# EasyEDA schematic RS-core-schematic.json
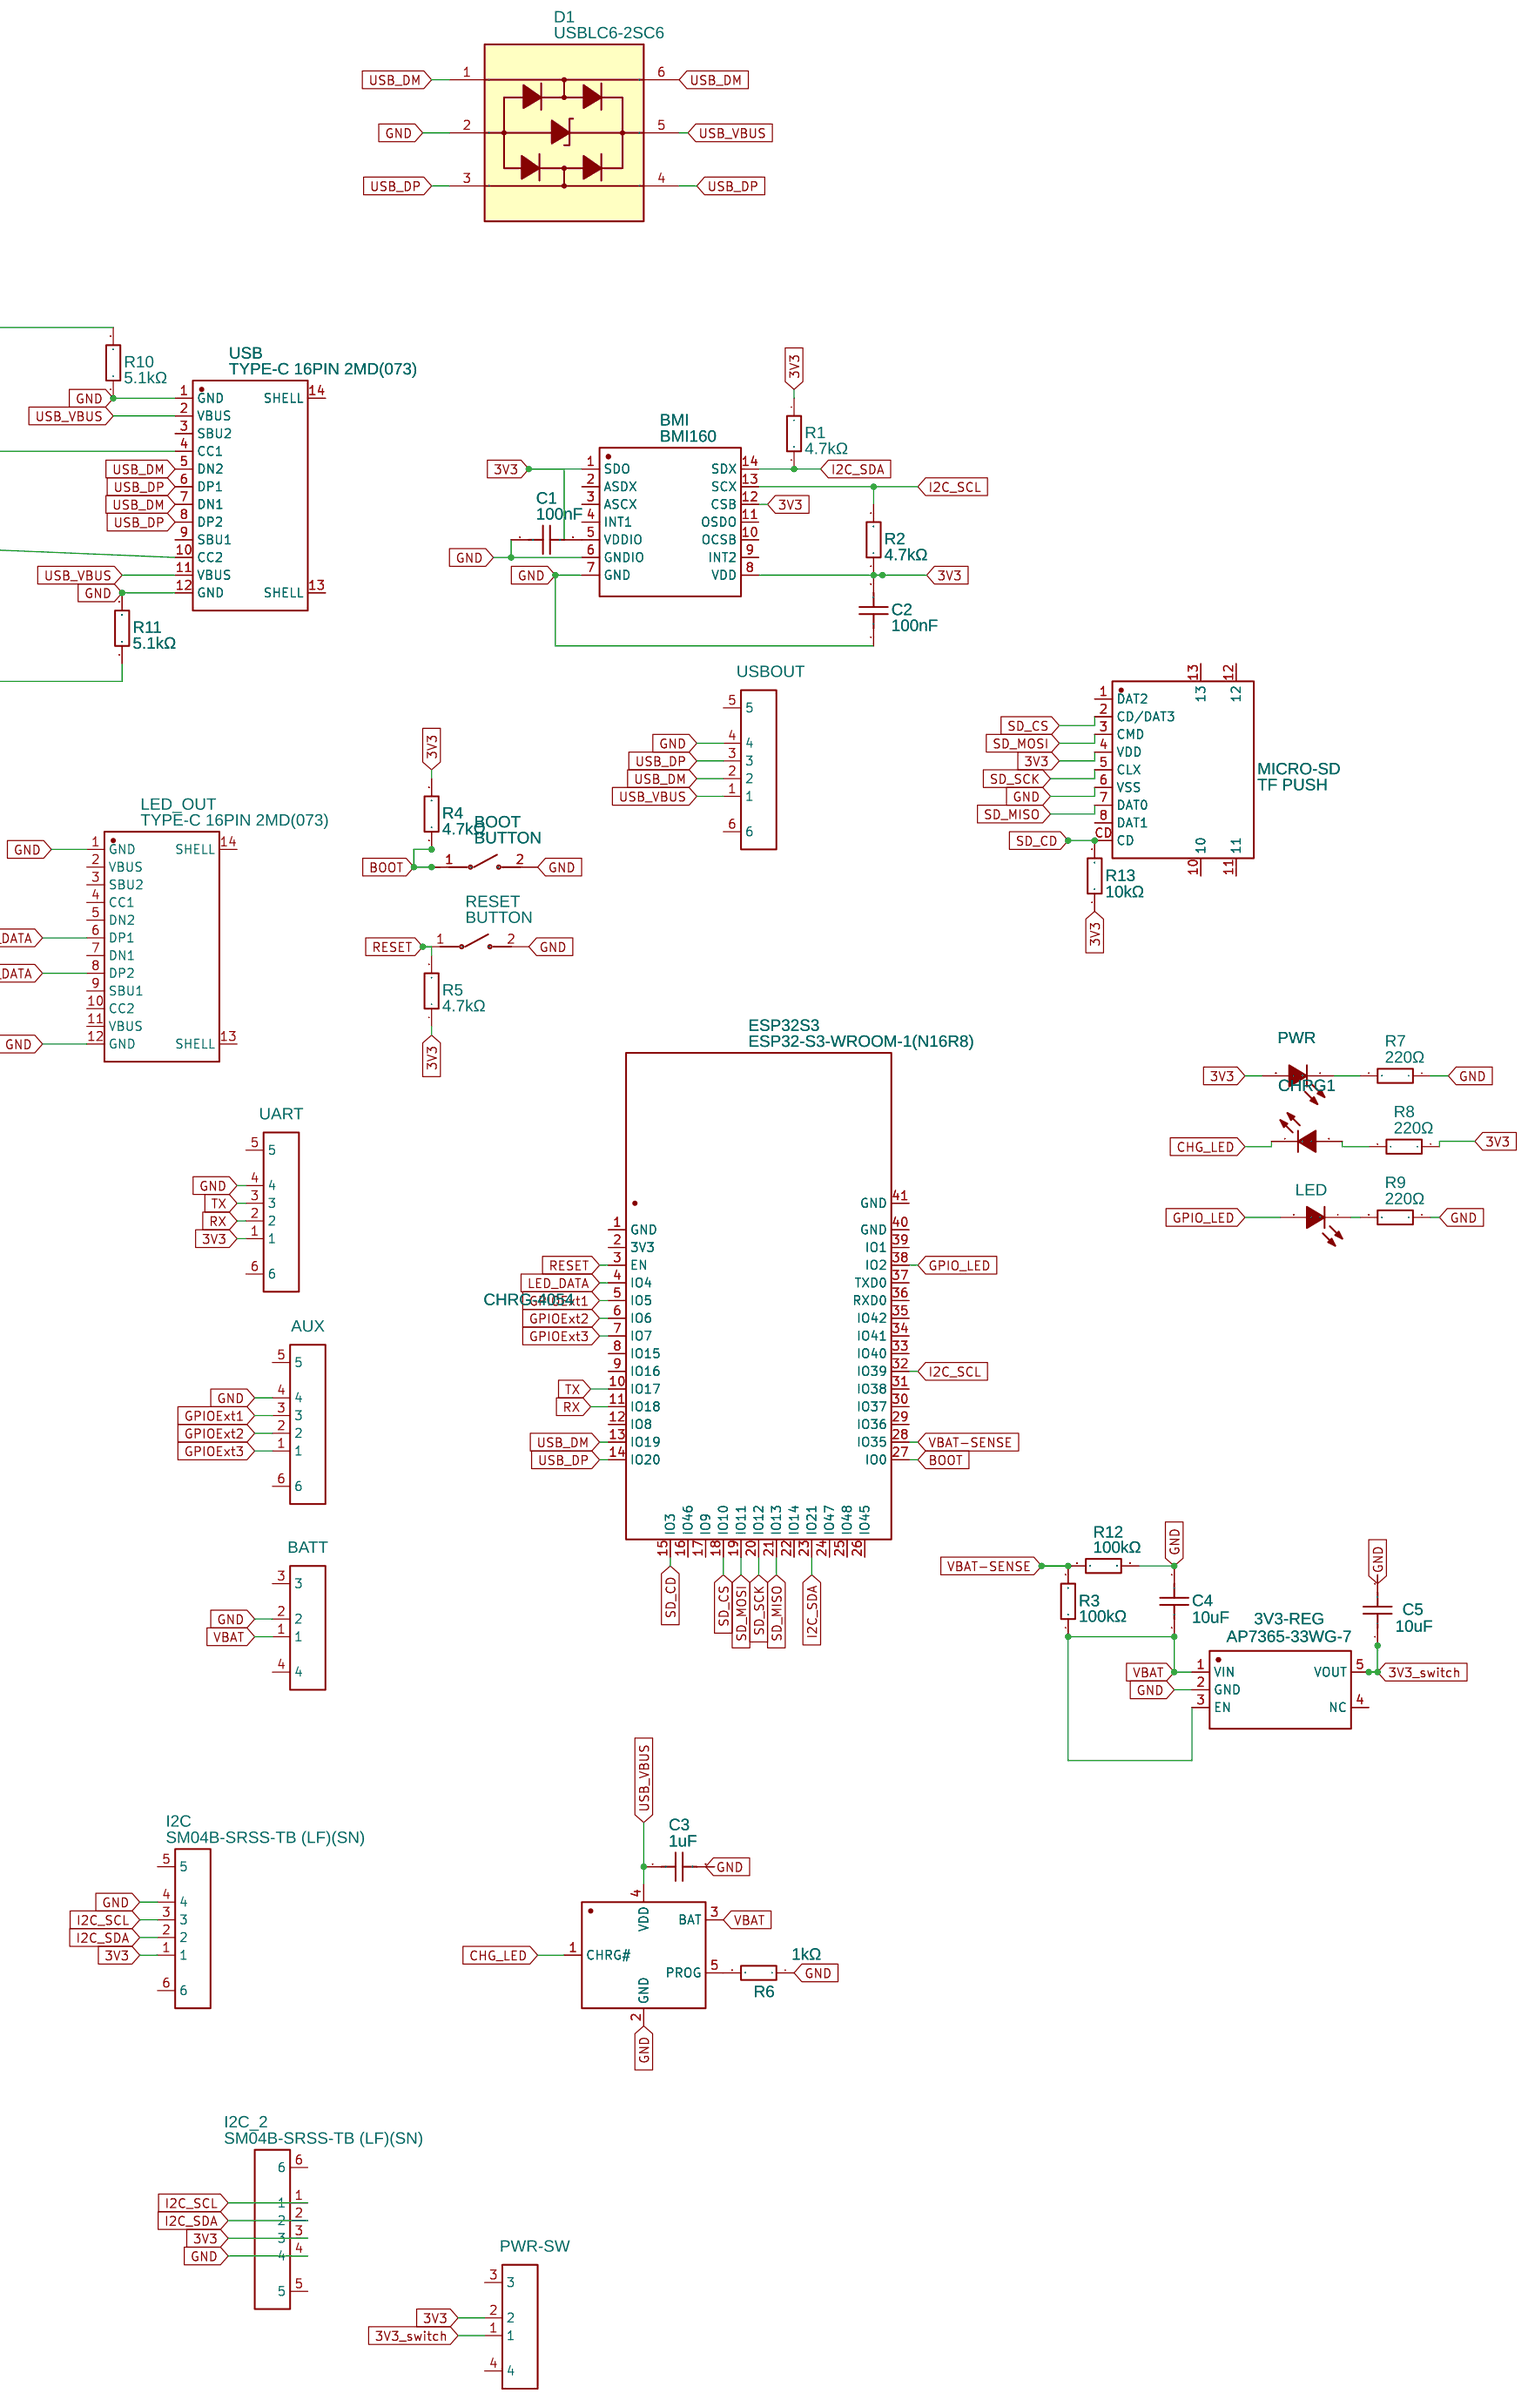
[diagram p0: schematic sheet]

## Parts
3V3-REG  AP7365-33WG-7  [SOT-25_L3.0-W1.6-P0.95-LS2.8-BR]
AUX  SM04B-SRSS-TB (LF)(SN)  [CONN-SMD_4P-P1.00_SM04B-SRSS-TB-LF-SN]
BATT  SM02B-SRSS-TB (LF)(SN)  [CONN-SMD_2P-P1.00_SM02B-SRSS-TB-LF-SN]
BMI  BMI160  [LGA-14_L3.0-W2.5-P0.50-BL]
BOOT  BUTTON  [SW-SMD_L3.9-W2.9-LS4.9-L]
C1  100nF  [C0603]
C2  100nF  [C0603]
C3  1uF  [C0603]
C4  10uF  [C0603]
C5  10uF  [C0603]
CHRG1  19-217/BHC-ZL1M2RY/3T  [LED0603-FD_BLUE]
CHRG-4054  Chrg-4054  [SOT-23-5_L2.9-W1.6-P0.95-LS2.8-BR]
D1  USBLC6-2SC6  [SOT-23-6_L2.9-W1.6-P0.95-LS2.8-BL]
ESP32S3  ESP32-S3-WROOM-1(N16R8)  [WIRELM-SMD_ESP32-S3-WROOM-1]
I2C  SM04B-SRSS-TB (LF)(SN)  [CONN-SMD_4P-P1.00_SM04B-SRSS-TB-LF-SN]
I2C_2  SM04B-SRSS-TB (LF)(SN)  [CONN-SMD_4P-P1.00_SM04B-SRSS-TB-LF-SN]
LED  19-217/BHC-ZL1M2RY/3T  [LED0603-FD_BLUE]
LED_OUT  TYPE-C 16PIN 2MD(073)  [USB-C-SMD_TYPE-C-6PIN-2MD-073]
MICRO-SD  TF PUSH  [TF-SMD_TF-PUSH]
PWR  19-217/BHC-ZL1M2RY/3T  [LED0603-FD_BLUE]
PWR-SW  SM02B-SRSS-TB (LF)(SN)  [CONN-SMD_2P-P1.00_SM02B-SRSS-TB-LF-SN]
R1  4.7kΩ  [R0603]
R2  4.7kΩ  [R0603]
R3  100kΩ  [R0603]
R4  4.7kΩ  [R0603]
R5  4.7kΩ  [R0603]
R6  1kΩ  [R0603]
R7  220Ω  [R0603]
R8  220Ω  [R0603]
R9  220Ω  [R0603]
R10  5.1kΩ  [R0603]
R11  5.1kΩ  [R0603]
R12  100kΩ  [R0603]
R13  10kΩ  [R0603]
RESET  BUTTON  [SW-SMD_L3.9-W2.9-LS4.9-L]
UART  SM04B-SRSS-TB (LF)(SN)  [CONN-SMD_4P-P1.00_SM04B-SRSS-TB-LF-SN]
USB  TYPE-C 16PIN 2MD(073)  [USB-C-SMD_TYPE-C-6PIN-2MD-073]
USBOUT  SM04B-SRSS-TB (LF)(SN)  [CONN-SMD_4P-P1.00_SM04B-SRSS-TB-LF-SN]

## Library data of the parts
3V3-REG = AP7365-33WG-7: Contributor: LCSC; Supplier: LCSC; Manufacturer: DIODES(美台); Supplier Part: C150742; JLCPCB Part Class: Extended Part
AUX I2C I2C_2 UART USBOUT = SM04B-SRSS-TB (LF)(SN): Contributor: LCSC; Supplier: LCSC; Supplier Part: C160404; Manufacturer: JST; Manufacturer Part: SM04B-SRSS-TB(LF)(SN); JLCPCB Part Class: Extended Part
BATT PWR-SW = SM02B-SRSS-TB (LF)(SN): Contributor: LCSC; Supplier: LCSC; Supplier Part: C160402; Manufacturer: JST; Manufacturer Part: SM02B-SRSS-TB(LF)(SN); JLCPCB Part Class: Extended Part
BMI = BMI160: Supplier: LCSC; Manufacturer: Bosch(博世); Supplier Part: C94021; JLCPCB Part Class: Extended Part
BOOT RESET = BUTTON: Contributor: lcsc; Supplier: LCSC; Supplier Part: C9900015607; Manufacturer: null; JLCPCB Part Class: Extended Part
C1-C5 = GCQ1555C1HR10WB01D: Contributor: LCSC; Supplier: LCSC; Supplier Part: C2268185; Manufacturer: muRata(村田); JLCPCB Part Class: Extended Part
CHRG1 LED PWR = 19-217/BHC-ZL1M2RY/3T: Supplier: LCSC; Manufacturer: EVERLIGHT(亿光); Supplier Part: C72041; JLCPCB Part Class: Extended Part
CHRG-4054 = TP4054(LX): Supplier: LCSC; Supplier Part: C45384876; Manufacturer: LX(灵星芯微); Contributor: lcsc
D1 = USBLC6-2SC6: Supplier: LCSC; Manufacturer: ST(意法半导体); Supplier Part: C7519; JLCPCB Part Class: Extended Part
ESP32S3 = ESP32-S3-WROOM-1(N16R8): Contributor: lcsc; Supplier: LCSC; Supplier Part: C2913202; Manufacturer: ESPRESSIF(乐鑫); Manufacturer Part: ESP32-S3-WROOM-1-N16R8; JLCPCB Part Class: Extended Part
LED_OUT USB = TYPE-C 16PIN 2MD(073): Contributor: LCSC; Supplier: LCSC; Supplier Part: C2765186; Manufacturer: SHOU HAN(首韩); JLCPCB Part Class: Extended Part
MICRO-SD = TF PUSH: Contributor: LCSC; Supplier: LCSC; Supplier Part: C393941; Manufacturer: SHOU HAN(首韩); JLCPCB Part Class: Extended Part
R1 R2 = RMC04024.7K1%N: Contributor: LCSC; Supplier: LCSC; Supplier Part: C270129; Manufacturer: Tyohm(幸亚电阻); Manufacturer Part: RMC04024K7FN; JLCPCB Part Class: Extended Part
R3 R12 = 0603WAF1003T5E: Supplier: LCSC; Manufacturer: UNI-ROYAL(厚声); Supplier Part: C25803; JLCPCB Part Class: Basic Part
R4-R11 = CR254701F: Contributor: lcsc; Supplier: LCSC; Supplier Part: C4155953; Manufacturer: Meritek; JLCPCB Part Class: Extended Part
R13 = 0603WAF1002T5E: Supplier: LCSC; Manufacturer: UNI-ROYAL(厚声); Supplier Part: C25804; JLCPCB Part Class: Basic Part

## Nets
3V3: BMI.1(SDO) BMI.8(VDD) BMI.12(CSB) C2.2 I2C.1 I2C_2.3 MICRO-SD.4(VDD) PWR.2(A) PWR-SW.2 R1.1 R2.1 R4.2 R5.1 R8.1 R13.1 UART.1
3V3_switch: 3V3-REG.5(VOUT) C5.1 PWR-SW.1
GND: 3V3-REG.2(GND) AUX.4 BATT.2 BMI.6(GNDIO) BMI.7(GND) BOOT.2 C1.2 C2.1 C3.2 C4.1 C5.2 CHRG-4054.2(GND) D1.2 I2C.4 I2C_2.4 LED_OUT.1(GND) LED_OUT.12(GND) MICRO-SD.6(VSS) R6.1 R7.1 R9.1 R10.1 R11.2 R12.2 RESET.2 UART.4 USB.1(GND) USB.12(GND) USBOUT.4
VBAT: 3V3-REG.1(VIN) 3V3-REG.3(EN) BATT.1 C4.2 CHRG-4054.3(BAT) R3.1
VBAT-SENSE: ESP32S3.28(IO35) R3.2 R12.1
BOOT: BOOT.1 ESP32S3.27(IO0) R4.1
CHG_LED: CHRG1.1(C) CHRG-4054.1(CHRG#)
GPIO_LED: ESP32S3.38(IO2) LED.2(A)
GPIOExt1: AUX.3 ESP32S3.5(IO5)
GPIOExt2: AUX.2 ESP32S3.6(IO6)
GPIOExt3: AUX.1 ESP32S3.7(IO7)
I2C_SCL: BMI.13(SCX) ESP32S3.32(IO39) I2C.3 I2C_2.1 R2.2
I2C_SDA: BMI.14(SDX) ESP32S3.23(IO21) I2C.2 I2C_2.2 R1.2
LED_DATA: ESP32S3.4(IO4) LED_OUT.6(DP1) LED_OUT.8(DP2)
RESET: ESP32S3.3(EN) R5.2 RESET.1
RX: ESP32S3.11(IO18) UART.2
SD_CD: ESP32S3.15(IO3) MICRO-SD.CD R13.2
SD_CS: ESP32S3.18(IO10) MICRO-SD.2(CD/DAT3)
SD_MISO: ESP32S3.21(IO13) MICRO-SD.7(DAT0)
SD_MOSI: ESP32S3.19(IO11) MICRO-SD.3(CMD)
SD_SCK: ESP32S3.20(IO12) MICRO-SD.5(CLX)
TX: ESP32S3.10(IO17) UART.3
USB_DM: D1.1 D1.6 ESP32S3.13(IO19) USB.5(DN2) USB.7(DN1) USBOUT.2
USB_DP: D1.3 D1.4 ESP32S3.14(IO20) USB.6(DP1) USB.8(DP2) USBOUT.3
USB_VBUS: C3.1 CHRG-4054.4(VDD) D1.5 USB.2(VBUS) USB.11(VBUS) USBOUT.1
Net-(BMI-5): BMI.5(VDDIO) C1.1
Net-(CHRG1-2): CHRG1.2(A) R8.2
Net-(CHRG-4054-5): CHRG-4054.5(PROG) R6.2
Net-(LED-1): LED.1(C) R9.2
Net-(PWR-1): PWR.1(C) R7.2
Net-(R10-2): R10.2 USB.4(CC1)
Net-(R11-1): R11.1 USB.10(CC2)

Not connected (* = marked no-connect by the designer): 3V3-REG 4(NC); AUX 5 6; BATT 3 4; BMI 2(ASDX) 3(ASCX) 4(INT1) 9(INT2) 10(OCSB) 11(OSDO); ESP32S3 1(GND) 2(3V3) 8(IO15) 9(IO16) 12(IO8) 16(IO46) 17(IO9) 22(IO14) 24(IO47) 25(IO48) 26(IO45) 29(IO36) 30(IO37) 31(IO38) 33(IO40) 34(IO41) 35(IO42) 36(RXD0) 37(TXD0) 39(IO1) 40(GND) 41(GND); I2C 5 6; I2C_2 5 6; LED_OUT 2(VBUS) 3(SBU2) 4(CC1) 5(DN2) 7(DN1) 9(SBU1) 10(CC2) 11(VBUS) 13(SHELL) 14(SHELL); MICRO-SD 1(DAT2) 8(DAT1) 10 11 12 13; PWR-SW 3 4; UART 5 6; USB 3(SBU2) 9(SBU1) 13(SHELL) 14(SHELL); USBOUT 5 6
